# EAGLE design init_test (EAGLE 8.2.2)
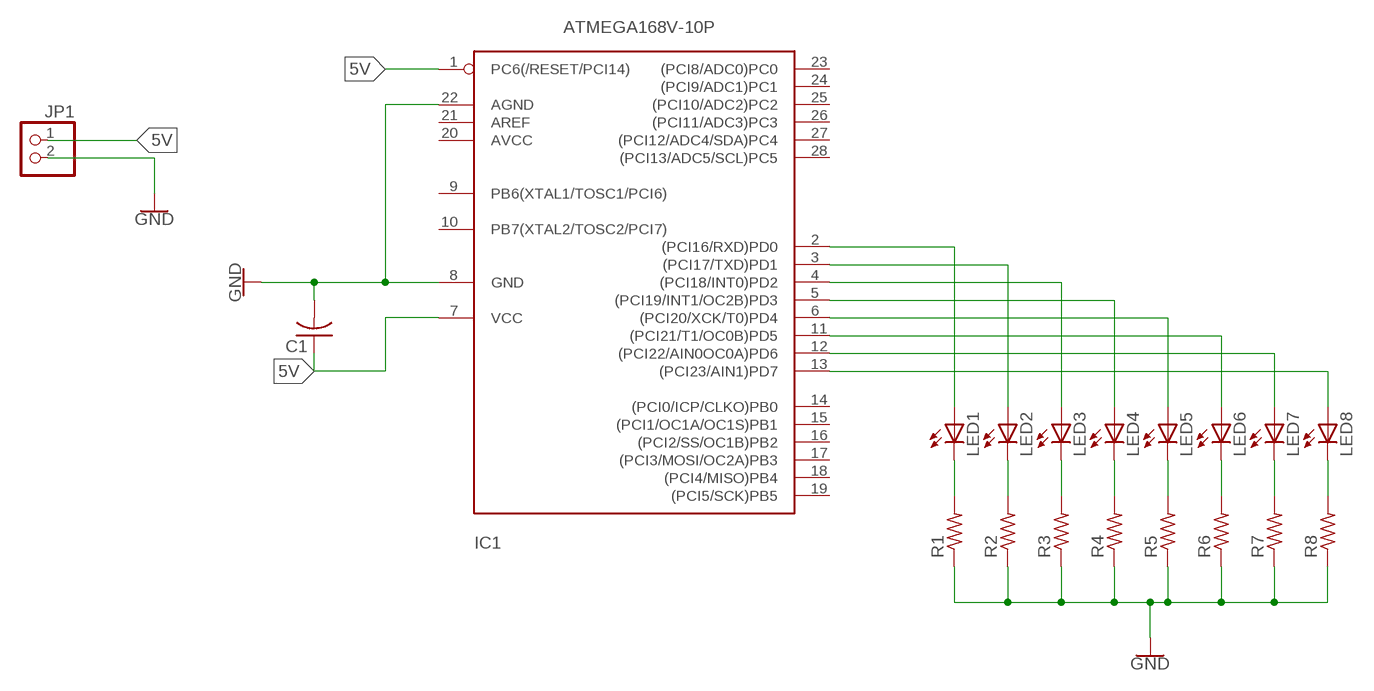
[diagram p0: schematic, sheet 1]

## Parts
C1  C-US025-030X050  [C025-030X050]
IC1  ATMEGA168V-10P  [DIL28-3]
JP1  PINHD-1X2  [1X02]
LED1  LED3MM  [LED3MM]
LED2  LED3MM  [LED3MM]
LED3  LED3MM  [LED3MM]
LED4  LED3MM  [LED3MM]
LED5  LED3MM  [LED3MM]
LED6  LED3MM  [LED3MM]
LED7  LED3MM  [LED3MM]
LED8  LED3MM  [LED3MM]
R1  R-US_0207/7  [0207/7]
R2  R-US_0207/7  [0207/7]
R3  R-US_0207/7  [0207/7]
R4  R-US_0207/7  [0207/7]
R5  R-US_0207/7  [0207/7]
R6  R-US_0207/7  [0207/7]
R7  R-US_0207/7  [0207/7]
R8  R-US_0207/7  [0207/7]

## Nets
5V: C1.1 IC1.1(PC6(/RESET/PCI14)) IC1.7(VCC) JP1.1
GND: C1.2 IC1.8(GND) IC1.22(AGND) JP1.2 R1.1 R2.1 R3.1 R4.1 R5.1 R6.1 R7.1 R8.1
N$1: LED1.K(C) R1.2
N$2: LED2.K(C) R2.2
N$3: LED3.K(C) R3.2
N$4: LED4.K(C) R4.2
N$5: LED5.K(C) R5.2
N$6: LED6.K(C) R6.2
N$7: LED7.K(C) R7.2
N$8: LED8.K(C) R8.2
N$10: IC1.2((PCI16/RXD)PD0) LED1.A
N$11: IC1.3((PCI17/TXD)PD1) LED2.A
N$12: IC1.4((PCI18/INT0)PD2) LED3.A
N$13: IC1.5((PCI19/INT1/OC2B)PD3) LED4.A
N$14: IC1.6((PCI20/XCK/T0)PD4) LED5.A
N$15: IC1.11((PCI21/T1/OC0B)PD5) LED6.A
N$16: IC1.12((PCI22/AIN0OC0A)PD6) LED7.A
N$17: IC1.13((PCI23/AIN1)PD7) LED8.A
Unconnected: IC1.9(PB6(XTAL1/TOSC1/PCI6)) IC1.10(PB7(XTAL2/TOSC2/PCI7)) IC1.14((PCI0/ICP/CLKO)PB0) IC1.15((PCI1/OC1A/OC1S)PB1) IC1.16((PCI2/SS/OC1B)PB2) IC1.17((PCI3/MOSI/OC2A)PB3) IC1.18((PCI4/MISO)PB4) IC1.19((PCI5/SCK)PB5) IC1.20(AVCC) IC1.21(AREF) IC1.23((PCI8/ADC0)PC0) IC1.24((PCI9/ADC1)PC1) IC1.25((PCI10/ADC2)PC2) IC1.26((PCI11/ADC3)PC3) IC1.27((PCI12/ADC4/SDA)PC4) IC1.28((PCI13/ADC5/SCL)PC5)

## Library data of the parts
C1 = adafruit:C-US: CAPACITOR, American symbol
IC1 = adafruit:ATMEGA168*P: MICROCONTROLLER 16 kBytes FLASH 1 kBytes SRAM 512 Bytes EEPROM USART 8-channel 10 bit ADC
JP1 = pinhead:PINHD-1X2: PIN HEADER
LED1-LED8 = adafruit:LED: LED OSRAM: - CHIPLED LG R971, LG N971, LY N971, LG Q971, LY Q971, LO R971, LY R971 LH N974, LH R974 LS Q976, LO Q976, LY Q976 LO Q996 - Hyper CHIPLED LW Q18S LB Q993, LB Q99A, LB R99A - SideLED LS A670, LO A670, LY A670, LG A670, LP A670 LB A673, LV A673, LT A673, LW A673 LH A674 LY A675 LS A676, LA A676, LO A676, LY A676, LW A676 LS A679, LY A679, LG A679 - Hyper Micro SIDELED® LS Y876, LA Y876, LO Y876, LY Y876 LT Y87S - SmartLED LW L88C, LW L88S LB L89C, LB L89S, LG L890 LS L89K, LO L89K, LY L89K LS L896, LA L896, LO L896, LY L896 - TOPLED LS T670, LO T670, LY T670, LG T670, LP T670 LSG T670, LSP T670, LSY T670, LOP T670, LYG T670 LG T671, LOG T671, LSG T671 LB T673, LV T673, LT T673, LW T673 LH T674 LS T676, LA T676, LO T676, LY T676, LB T676, LH T676, LSB T676, LW T676 LB T67C, LV T67C, LT T67C, LS T67K, LO T67K, LY T67K, LW E67C LS E67B, LA E67B, LO E67B, LY E67B, LB E67C, LV E67C, LT E67C LW T67C LS T679, LY T679, LG T679 LS T770, LO T770, LY T770, LG T770, LP T770 LB T773, LV T773, LT T773, LW T773 LH T774 LS E675, LA E675, LY E675, LS T675 LS T776, LA T776, LO T776, LY T776, LB T776 LHGB T686 LT T68C, LB T68C - Hyper Mini TOPLED® LB M676 - Mini TOPLED Santana® LG M470 LS M47K, LO M47K, LY M47K Source: http://www.osram.convergy.de/
R1-R8 = adafruit:R-US_: RESISTOR, American symbol

## Board
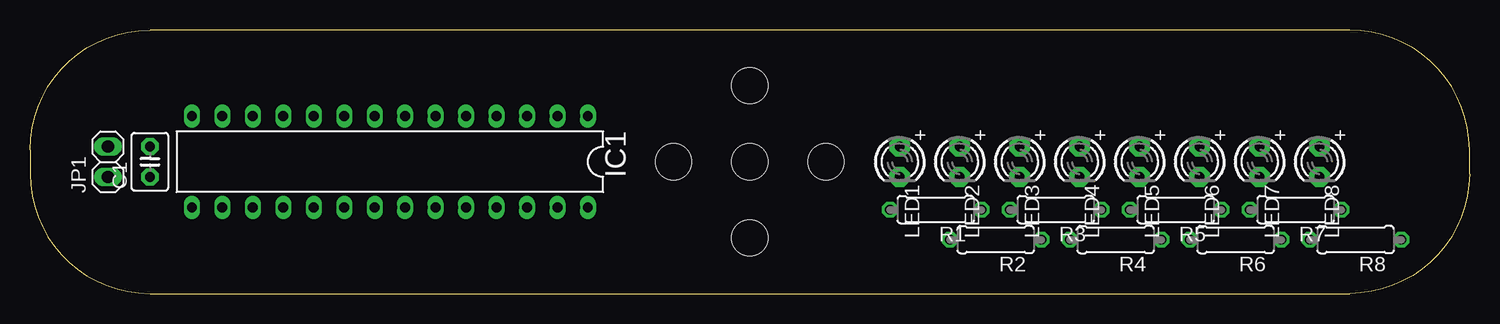
[diagram p1: board, top side]
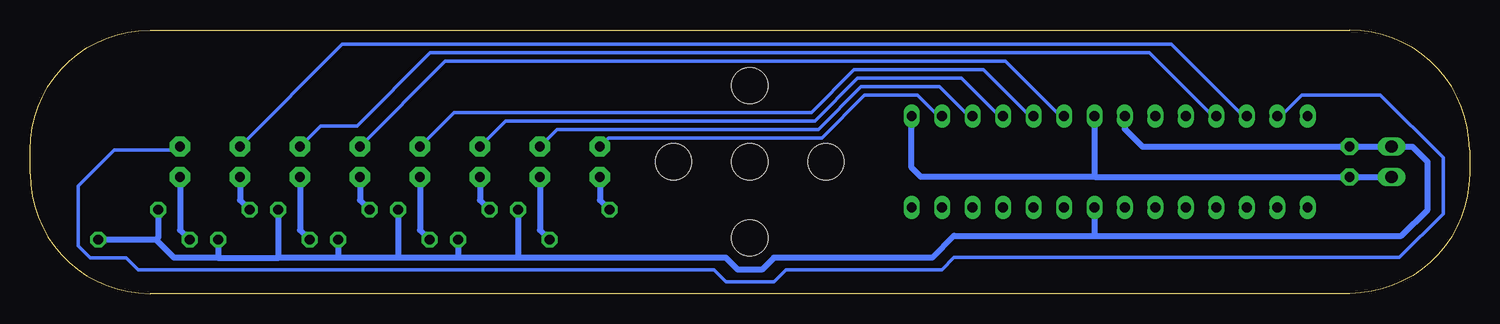
[diagram p2: board, bottom side, seen from below]

Size 120 x 22 mm. Coordinates in mm from the lower left corner, seen from the top.
Outline: 10,0 110,0 arc90 120,10 120,12 arc90 110,22 10,22 arc90 0,12 0,10 arc90 10,0
Copper layers (1*16): Top 0.035mm / dielectric 1.5mm / Bottom 0.035mm
Design rules "OthermillDRC_1_100_v2": minimum track width 8mil, minimum drill 0.8mm, track to track 0.256540625mm, track to pad 0.256540625mm, pad to pad 0.256540625mm, via to via 0.256540625mm, smd to smd 0mil, copper to edge 0mil, drill to drill 1mil, minimum pad ring 10mil, minimum via ring 10mil, stop-mask expansion 1mil, vias tented up to drill 30mil, thermal gap 10mil
Holes 3 mm at 60,11 60,4.65 60,17.35 66.35,11 53.65,11

### Footprints (pad centres in the part's own frame; a part is rotated, then mirrored left to right if it is on the bottom)
C025-030X050 = drill 0.813 pad 1.422 octagon: 1 -1.27,0; 2 1.27,0
DIL28-3 = drill 0.813 long: 1 -16.51,-3.81; 2 -13.97,-3.81; 3 -11.43,-3.81; 4 -8.89,-3.81; 5 -6.35,-3.81; 6 -3.81,-3.81; 7 -1.27,-3.81; 8 1.27,-3.81; 9 3.81,-3.81; 10 6.35,-3.81; 11 8.89,-3.81; 12 11.43,-3.81; 13 13.97,-3.81; 14 16.51,-3.81; 15 16.51,3.81; 16 13.97,3.81; 17 11.43,3.81; 18 8.89,3.81; 19 6.35,3.81; 20 3.81,3.81; 21 1.27,3.81; 22 -1.27,3.81; 23 -3.81,3.81; 24 -6.35,3.81; 25 -8.89,3.81; 26 -11.43,3.81; 27 -13.97,3.81; 28 -16.51,3.81
1X02 = drill 1.016 long: 1 -1.27,0; 2 1.27,0
LED3MM = drill 0.813 pad 1.676 octagon: A -1.27,0; K 1.27,0
0207/7 = drill 0.813 octagon: 1 -3.81,0; 2 3.81,0

### Placement (x,y rotation side)
C1  10,11 90 top
IC1  30,11 180 top
JP1  6.5,11 90 top
LED1  72.5,11 270 top
LED2  77.5,11 270 top
LED3  82.5,11 270 top
LED4  87.5,11 270 top
LED5  92.5,11 270 top
LED6  97.5,11 270 top
LED7  102.5,11 270 top
LED8  107.5,11 270 top
R1  75.5,7 180 top
R2  80.5,4.5 180 top
R3  85.5,7 180 top
R4  90.5,4.5 180 top
R5  95.5,7 180 top
R6  100.5,4.5 180 top
R7  105.5,7 180 top
R8  110.5,4.5 180 top

### Tracks (layer width: path | path; a pad name or v marks a point on that pad's centre or on a via)
5V
  Bottom 0.508: JP1.1 C1.1 31.25,9.73 | IC1.1 46.51,10.51 45.73,9.73 31.25,9.73 | 31.25,9.73 31.27,9.75 IC1.7
GND
  Bottom 0.508: IC1.8 28.73,13.73 27.27,12.27 C1.2 JP1.2 4.77,12.27 3.5,11 3.5,7 5.68,4.82 31.37,4.82 | 31.37,4.82 42.97,4.82 44.79,3 58,3 59,2 61,2 62,3 79.15,3 | IC1.22 31.27,4.92 31.37,4.82 | 104.34,3 99.28,3 | 104.34,3 108,3 109.5,4.5 | 94.34,3 99.28,3 | 89.29,3 94.34,3 | 84.18,3 89.29,3 | 79.15,3 84.18,3 | 109.5,4.5 R8.1 | R7.1 109.31,4.69 109.5,4.5 | R5.1 99.31,3.03 99.28,3 | R4.1 94.31,3.03 94.34,3 | R3.1 89.31,3.02 89.29,3 | R2.1 84.31,3.13 84.18,3 | R1.1 79.31,3.16 79.15,3 | R6.1 104.31,3.03 104.34,3
N$1
  Bottom 0.508: LED1.K 72.5,7.81 R1.2
N$2
  Bottom 0.508: LED2.K 77.5,5.31 R2.2
N$3
  Bottom 0.508: LED3.K 82.5,7.81 R3.2
N$4
  Bottom 0.508: LED4.K 87.5,5.31 R4.2
N$5
  Bottom 0.508: LED5.K 92.5,7.81 R5.2
N$6
  Bottom 0.508: LED6.K 97.5,5.31 R6.2
N$7
  Bottom 0.508: LED7.K 102.5,7.81 R7.2
N$8
  Bottom 0.508: LED8.K 107.5,5.31 R8.2
N$10
  Bottom 0.305: IC1.2 44.26,14.81 46.03,16.58 50.42,16.58 54,13 71.77,13 LED1.A
N$11
  Bottom 0.305: IC1.3 41.72,14.81 44.19,17.28 50.71,17.28 54.29,13.7 76.07,13.7 LED2.A
N$12
  Bottom 0.305: IC1.4 39.18,14.81 42.36,17.99 51,17.99 54.58,14.41 80.36,14.41 LED3.A
N$13
  Bottom 0.305: LED4.A 84.66,15.11 54.87,15.11 51.29,18.69 40.52,18.69 36.64,14.81 IC1.5
N$14
  Bottom 0.305: IC1.6 34.1,14.81 38.68,19.39 85.38,19.39 LED5.A
N$15
  Bottom 0.305: IC1.11 21.4,14.81 26.69,20.1 86.64,20.1 92.73,14 95.77,14 LED6.A
N$16
  Bottom 0.305: IC1.12 18.86,14.81 24.85,20.8 93.97,20.8 LED7.A
N$17
  Bottom 0.305: IC1.13 15.74,14.81 13.97,16.58 7.44,16.58 2.19,11.33 2.19,6.67 5.84,3.02 42.98,3.02 44,2 57,2 58,1 62,1 63,2 111,2 112,3 115,3 116,4 116,9 113,12 107.77,12 LED8.A